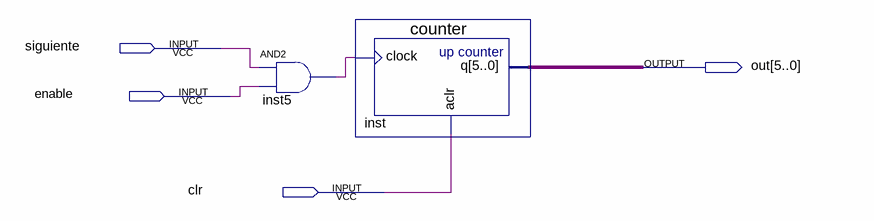
[diagram p0: schematic sheet]
// Quartus schematic contador6bits.bdf as structural Verilog: 2 symbols, 4 pins
module contador6bits (
  input  siguiente,
  input  enable,
  input  clr,
  output [5:0] out
);

  wire inst5_out;

  and inst5 (inst5_out, siguiente, enable);
  counter inst (.clock(inst5_out), .aclr(clr), .q(out));
endmodule
